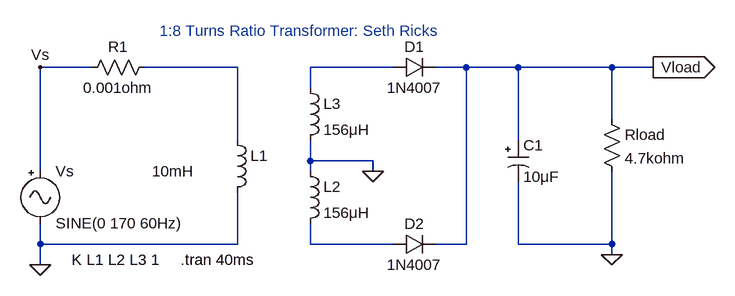
[diagram p0: schematic DiodeRectifier.asc]
DiodeRectifier.asc, the LTspice schematic file:
Version 4.1
SHEET 1 1020 680
WIRE 32 -192 -48 -192
WIRE 256 -192 112 -192
WIRE 496 -192 368 -192
WIRE 608 -192 560 -192
WIRE 688 -192 608 -192
WIRE 832 -192 688 -192
WIRE 896 -192 832 -192
WIRE 368 -160 368 -192
WIRE 832 -112 832 -192
WIRE 256 -80 256 -192
WIRE 688 -80 688 -192
WIRE 368 -48 368 -80
WIRE 464 -48 368 -48
WIRE -48 -32 -48 -192
WIRE 368 -32 368 -48
WIRE 464 -32 464 -48
WIRE -48 80 -48 48
WIRE 256 80 256 0
WIRE 256 80 -48 80
WIRE 368 80 368 48
WIRE 496 80 368 80
WIRE 608 80 608 -192
WIRE 608 80 560 80
WIRE 688 80 688 -16
WIRE 832 80 832 -32
WIRE 832 80 688 80
WIRE 832 96 832 80
WIRE -48 112 -48 80
FLAG -48 112 0
FLAG 896 -192 Vload
IOPIN 896 -192 Out
FLAG 832 96 0
FLAG 464 -32 0
FLAG -48 -192 Vs
SYMBOL Misc\\signal -48 -48 R0
SYMATTR InstName Vs
SYMATTR Value SINE(0 170 60Hz)
SYMBOL res 128 -208 R90
WINDOW 0 0 56 VBottom 2
WINDOW 3 32 56 VTop 2
SYMATTR InstName R1
SYMATTR Value 0.001ohm
SYMBOL ind 240 -96 R0
WINDOW 3 -116 64 Left 2
SYMATTR InstName L1
SYMATTR Value 10mH
SYMATTR Type ind
SYMBOL ind 352 -176 R0
SYMATTR InstName L3
SYMATTR Value 156μH
SYMATTR Type ind
SYMBOL ind 352 -48 R0
SYMATTR InstName L2
SYMATTR Value 156μH
SYMATTR Type ind
SYMBOL diode 496 -176 R270
WINDOW 0 32 32 VTop 2
WINDOW 3 0 32 VBottom 2
SYMATTR InstName D1
SYMATTR Value 1N4007
SYMBOL diode 496 96 R270
WINDOW 0 32 32 VTop 2
WINDOW 3 0 32 VBottom 2
SYMATTR InstName D2
SYMATTR Value 1N4007
SYMBOL res 816 -128 R0
SYMATTR InstName Rload
SYMATTR Value 4.7kohm
SYMBOL polcap 672 -80 R0
SYMATTR InstName C1
SYMATTR Value 10μF
TEXT 0 104 Left 2 !K L1 L2 L3 1
TEXT 168 104 Left 2 !.tran 40ms
TEXT 136 -248 Left 2 ;1:8 Turns Ratio Transformer: Seth Ricks

The netlist it stands for:
* DiodeRectifier.asc
Vs Vs 0 SINE(0 170 60Hz)
R1 N001 Vs 0.001ohm
L1 N001 0 10mH
L3 N002 0 156μH
L2 0 N003 156μH
D1 N002 Vload 1N4007
D2 N003 Vload 1N4007
Rload Vload 0 4.7kohm
C1 Vload 0 10μF
.model D D
.lib standard.dio
K L1 L2 L3 1
.tran 40ms
* 1:8 Turns Ratio Transformer: Seth Ricks
.backanno
.end

* Results of the author's LTspice run, read from the files saved beside the schematic
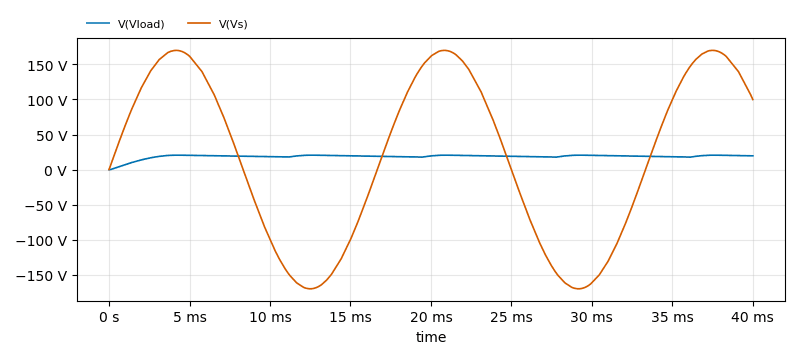
[diagram p1: Transient Analysis of DiodeRectifier.asc, plotted from the saved traces]
* Transient Analysis, 1 run:
*   V(Vload): min 0 V, max 20.59 V, average 18.64 V, rms 18.89 V, last 19.59 V
*   V(Vs): min -170 V, max 170 V, average 20.31 V, rms 122.1 V, last 99.92 V